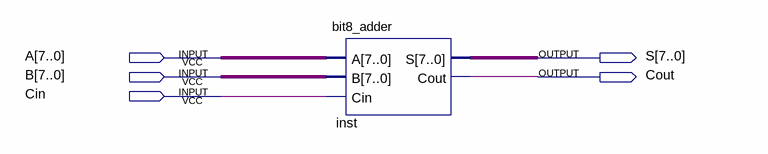
[diagram p0: schematic sheet]
// Quartus schematic er3.bdf as structural Verilog: 1 symbols, 5 pins
module er3 (
  input  [7:0] A,
  input  [7:0] B,
  input  Cin,
  output [7:0] S,
  output Cout
);

  bit8_adder inst (.A(A), .B(B), .Cin(Cin), .S(S), .Cout(Cout));
endmodule
